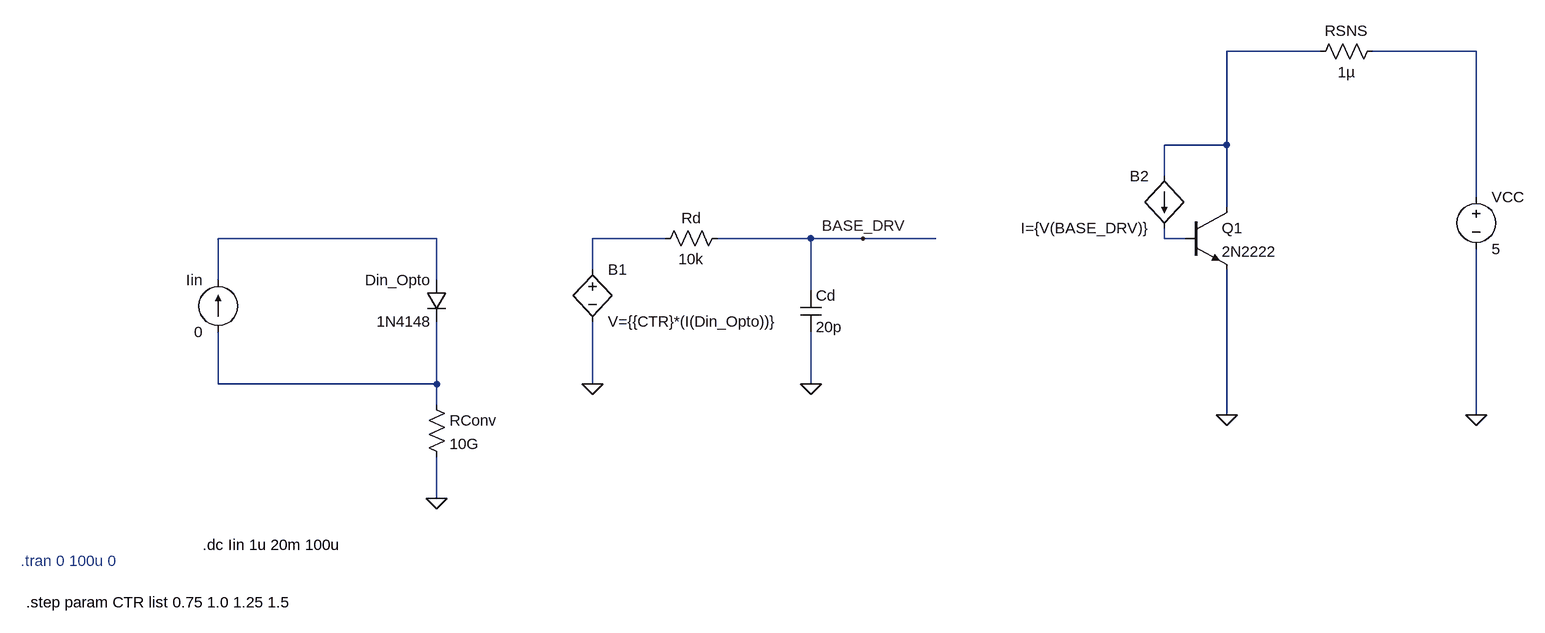
[diagram p0: schematic Optocoupler_Model.asc]
Optocoupler_Model.asc, the LTspice schematic file:
Version 4.1
SHEET 1 1868 680
WIRE 1504 -224 1360 -224
WIRE 1744 -224 1584 -224
WIRE 1360 -80 1360 -224
WIRE 1360 -80 1264 -80
WIRE 1264 -32 1264 -80
WIRE 1744 0 1744 -224
WIRE 1360 16 1360 -80
WIRE 144 64 -192 64
WIRE 496 64 384 64
WIRE 720 64 576 64
WIRE 800 64 720 64
WIRE 912 64 800 64
WIRE 1264 64 1264 48
WIRE 1296 64 1264 64
WIRE 384 112 384 64
WIRE -192 128 -192 64
WIRE 144 128 144 64
WIRE 720 144 720 64
WIRE -192 288 -192 208
WIRE 144 288 144 192
WIRE 144 288 -192 288
WIRE 384 288 384 192
WIRE 720 288 720 208
WIRE 144 320 144 288
WIRE 1360 336 1360 112
WIRE 1744 336 1744 80
WIRE 144 464 144 400
FLAG 144 464 0
FLAG 384 288 0
FLAG 720 288 0
FLAG 800 64 BASE_DRV
FLAG 1744 336 0
FLAG 1360 336 0
SYMBOL diode 160 128 M0
SYMATTR InstName Din_Opto
SYMATTR Value 1N4148
SYMBOL res 128 304 R0
SYMATTR InstName RConv
SYMATTR Value 10G
SYMBOL bv 384 96 R0
SYMATTR InstName B1
SYMATTR Value V={{CTR}*(I(Din_Opto))}
SYMBOL cap 704 144 R0
SYMATTR InstName Cd
SYMATTR Value 20p
SYMBOL res 592 48 R90
WINDOW 0 0 56 VBottom 2
WINDOW 3 32 56 VTop 2
SYMATTR InstName Rd
SYMATTR Value 10k
SYMBOL npn 1296 16 R0
SYMATTR InstName Q1
SYMATTR Value 2N2222
SYMBOL bi 1264 -32 M0
SYMATTR InstName B2
SYMATTR Value I={V(BASE_DRV)}
SYMBOL voltage 1744 -16 R0
WINDOW 123 0 0 Left 0
WINDOW 39 0 0 Left 0
SYMATTR InstName VCC
SYMATTR Value 5
SYMBOL current -192 208 R180
WINDOW 0 24 80 Left 2
WINDOW 3 24 0 Left 2
WINDOW 123 0 0 Left 0
WINDOW 39 0 0 Left 0
SYMATTR InstName Iin
SYMATTR Value 0
SYMBOL res 1600 -240 R90
WINDOW 0 0 56 VBottom 2
WINDOW 3 32 56 VTop 2
SYMATTR InstName RSNS
SYMATTR Value 1µ
TEXT -496 560 Left 2 ;.tran 0 100u 0
TEXT -488 624 Left 2 !.step param CTR list 0.75 1.0 1.25 1.5
TEXT -216 536 Left 2 !.dc Iin 1u 20m 100u

The netlist it stands for:
* Optocoupler_Model.asc
Din_Opto N003 N006 1N4148
RConv N006 0 10G
B1 N004 0 V={{CTR}*(I(Din_Opto))}
Cd BASE_DRV 0 20p
Rd BASE_DRV N004 10k
Q1 N001 N005 0 0 2N2222
B2 N001 N005 I={V(BASE_DRV)}
VCC N002 0 5
Iin N006 N003 0
RSNS N002 N001 1µ
.model D D
.lib standard.dio
.model NPN NPN
.model PNP PNP
.lib standard.bjt
* .tran 0 100u 0
.step param CTR list 0.75 1.0 1.25 1.5
.dc Iin 1u 20m 100u
.backanno
.end